# Altium schematic sheet Actuators.SchDoc
size A; SheetNumber: 4; SheetTotal: 4
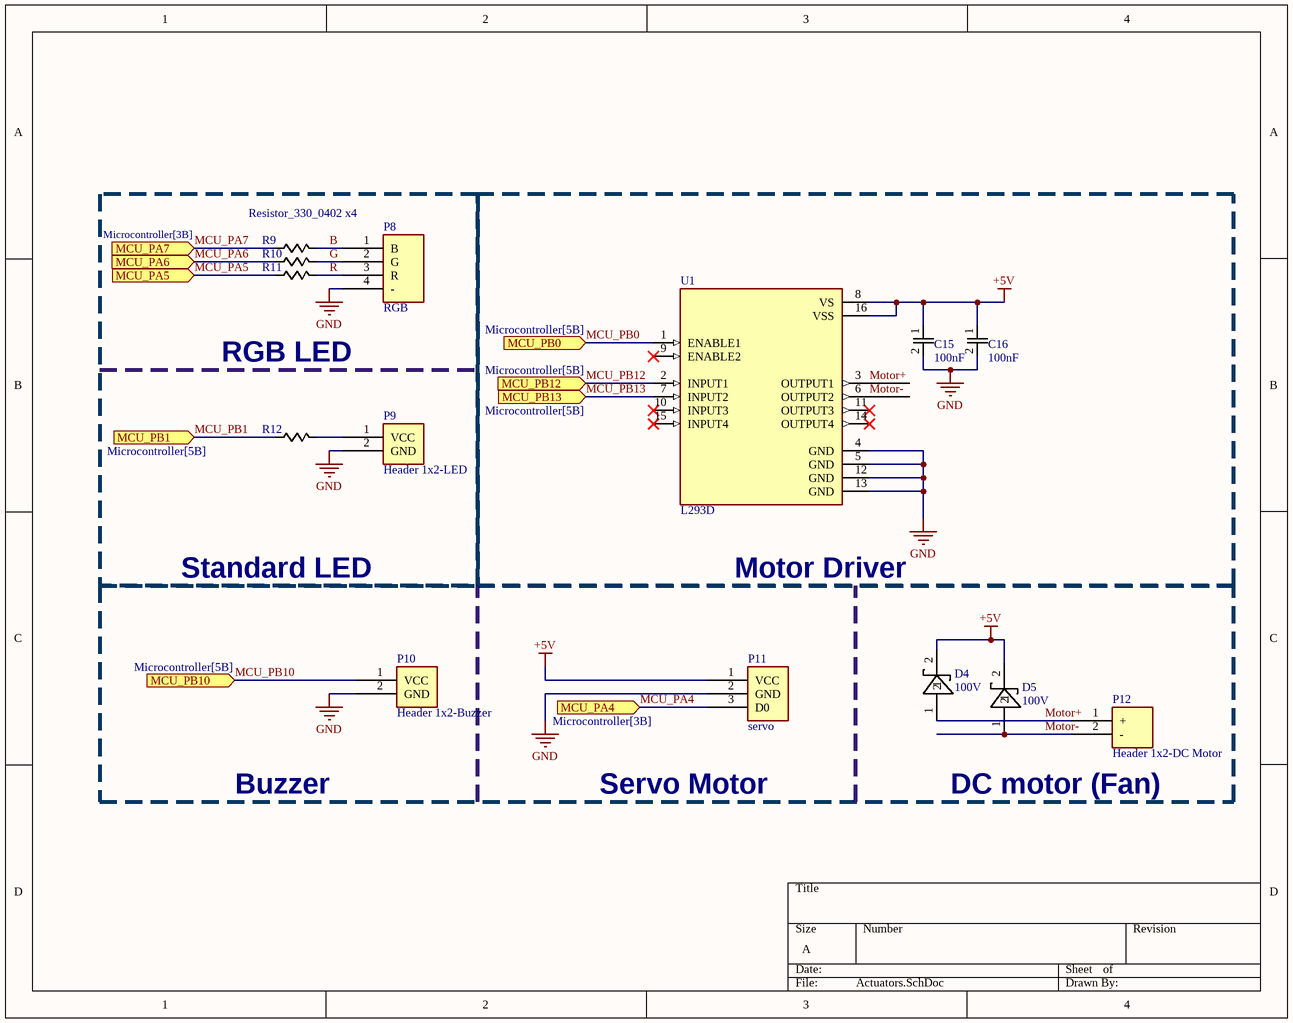
[diagram p0: Actuators.SchDoc]

## Parts
C15  100nF  [CAPC1005X55N]
C16  100nF  [CAPC1005X55N]
D4  100V  [Schottky.D]
D5  100V  [Schottky.D]
P8  RGB  [Header 1x4 male]
P9  Header 1x2-LED  [Header 1x2]
P10  Header 1x2-Buzzer  [Header 1x2]
P11  servo  [HEADER 1x3 MALE]
P12  Header 1x2-DC Motor  [Header 1x2]
R9  Resistor_330_0402 x4  [RESC1005X40N]
R10  Resistor_330_0402  [RESC1005X40N]  (value not drawn)
R11  Resistor_330_0402  [RESC1005X40N]  (value not drawn)
R12  Resistor_330_0402  [RESC1005X40N]  (value not drawn)
U1  L293D  [DIP880W50P254L2000H510Q16]

## Blocks framed on the sheet
Motor Driver: C15 C16 U1

## Ports
MCU_PA4 (in, see Microcontroller[3B]), MCU_PA5 (in, see Microcontroller[3B]), MCU_PA6 (in, see Microcontroller[3B]), MCU_PA7 (in, see Microcontroller[3B]), MCU_PB0 (in, see Microcontroller[5B]), MCU_PB1 (in, see Microcontroller[5B]), MCU_PB10 (in, see Microcontroller[5B]), MCU_PB12 (in, see Microcontroller[5B]), MCU_PB13 (in, see Microcontroller[5B])

## Nets
+5V: C15.1 C16.1 D4.2 D5.2 P11.1(VCC) U1.8(VS) U1.16(VSS)
GND: C15.2 C16.2 P8.4(-) P9.2(GND) P10.2(GND) P11.2(GND) U1.4(GND) U1.5(GND) U1.12(GND) U1.13(GND)
B: P8.1(B) R9.2
G: P8.2(G) R10.2
MCU_PA4: P11.3(D0) ; port MCU_PA4
MCU_PA5: R11.1 ; port MCU_PA5
MCU_PA6: R10.1 ; port MCU_PA6
MCU_PA7: R9.1 ; port MCU_PA7
MCU_PB0: U1.1(ENABLE1) ; port MCU_PB0
MCU_PB1: R12.1 ; port MCU_PB1
MCU_PB10: P10.1(VCC) ; port MCU_PB10
MCU_PB12: U1.2(INPUT1) ; port MCU_PB12
MCU_PB13: U1.7(INPUT2) ; port MCU_PB13
Motor+: D4.1 P12.1(+) U1.3(OUTPUT1)
Motor-: D5.1 P12.2(-) U1.6(OUTPUT2)
R: P8.3(R) R11.2
NetP9_1: P9.1(VCC) R12.2

Not connected (* = marked no-connect by the designer): U1 9(ENABLE2)* 10(INPUT3)* 11(OUTPUT3)* 14(OUTPUT4)* 15(INPUT4)*

## Notes on the sheet
- RGB LED
- Standard LED
- Buzzer
- Servo Motor
- (near P12) DC motor (Fan)

## Library data of the parts
C15 C16 = Cap_100nF_0402: CAP CER 100nF 16V X7R 0402; Manufacturer: Samsung Electro-Mechanics; Manufacturer Part #: CL05B104KO5NNNC; Supplier: LCSC; Supplier Part#: C1525; ComponentLink1Description: Data Sheet; ComponentLink1URL: https://www.lcsc.com/datasheet/C1525.pdf?spm=wm.sxq.inf.ggs___wm.fly.bg.1.stp&lcsc_vid=T1MKV1cAE1gLBAVfTgIKUgJfTlkPBQBVQlMMBAJURwAxVlNeT1dfVlxVQ1ReXzsOAxUeFF5JWBYZEEoKFBINSQcJGk4%3D
D4 D5 = Schottky_D: 100V 850mV@5A 5A SMAG Schottky Diodes ROHS; Manufacturer: Nexperia; Mfr. Part #: BAT54S,215; Splr.part#: C466506; Supplier: LCSC; ComponentLink1Description: New link; ComponentLink1URL: https://www.lcsc.com/product-detail/C466506.html?s_z=n_schottky%2520diode
P8 = Header 1x4-RGB_LED: HW-479 is a versatile RGB LED module with PWM control for vibrant color mixing, ideal for Arduino and microcontroller projects.; Supplier: Makers Electronics; Supplier Part#: 5597455270331; ComponentLink1Description: Link; ComponentLink1URL: https://makerselectronics.com/product/hw-479-rgb-led-module/
P9 = Header 1x2-LED: Round Transparent LED 3mm 2Pin available in blue and red colors is Bright and efficient, ideal for indicators, DIY electronics, and display applications.; Supplier: Makers Electronics; ComponentLink1Description: Link; ComponentLink1URL: https://makerselectronics.com/product/round-transparent-led-3mm-2pin/
P10 = Header 1x2-Buzzer: SFM-20B Piezo Buzzer Alarm 3-24VDC 95dB 23x12mm is a compact, active piezoelectric alarm buzzer for continuous audible alerts in low‑voltage DC systems.; Supplier: Makers Electronics; Supplier Part#: 3496300135059; ComponentLink1Description: Link; ComponentLink1URL: https://makerselectronics.com/product/sfm-20b-piezo-buzzer-alarm-3-24vdc-95db-23x12mm/
P11 = Header 1x3-Servo: servo-180-degree/; Supplier: Makers Electronics; Supplier Part#: 300000009139; ComponentLink1Description: Link; ComponentLink1URL: https://makerselectronics.com/product/sg90-micro-servo-180-degree/
P12 = Header 1x2-DC Motor: Compact OSEPP LS-00027 R280 brushed DC motor. Features 3-6V operation and a 2mm shaft. Ideal for robotics, DIY hobbies, and educational science projects.; Supplier: Makers Electronics; Supplier Part#: 667510001714; ComponentLink1Description: Link; ComponentLink1URL: https://makerselectronics.com/product/osepp-12000-rpm-dc-motor/
R9-R12 = Resistor_330_0402: RES 330Ω ±1% 62.5mW 0402; Manufacturer: YAGEO; Manufacturer Part #: RC0402FR-07330RL; Supplier: LCSC; Supplier Part #: C105875; ComponentLink1Description: Data Sheet; ComponentLink1URL: https://www.lcsc.com/datasheet/C105875.pdf?spm=wm.sxq.inf.ggs___wm.fly.bg.0.stp&lcsc_vid=RFcPU1ZSEVdeBFReRgUKAgZXQAMKBQJURFUIAwVSQVgxVlNeT1dXUFZUTldcVjsOAxUeFF5JWBYZEEoKFBINSQcJGk4NBhADEA4cHktXR1BYSQwSGg0%3D
U1 = L293D: Bipolar Motor Driver - Parallel 16-PowerDIP; Manufacturer: ST; Manufacturer Part#: L293D; Supplier: LCSC; Supplier Part#: C12340; ComponentLink1Description: Data Sheet; ComponentLink1URL: https://www.lcsc.com/datasheet/C12340.pdf?spm=wm.sxq.inf.ggs___wm.fly.bg.0.stp&lcsc_vid=QldaXwVWQ1ALVwBSRFNdXlZQFAAIVQZWQQAMUgIAQVkxVlNeT1dWUFZSRlFfVjsOAxUeFF5JWBYZEEoKFBINSQcJGk4%3D